# Altium schematic sheet MCU.SchDoc
size 177 x 114 mm; SheetNumber: 1; SheetTotal: 1
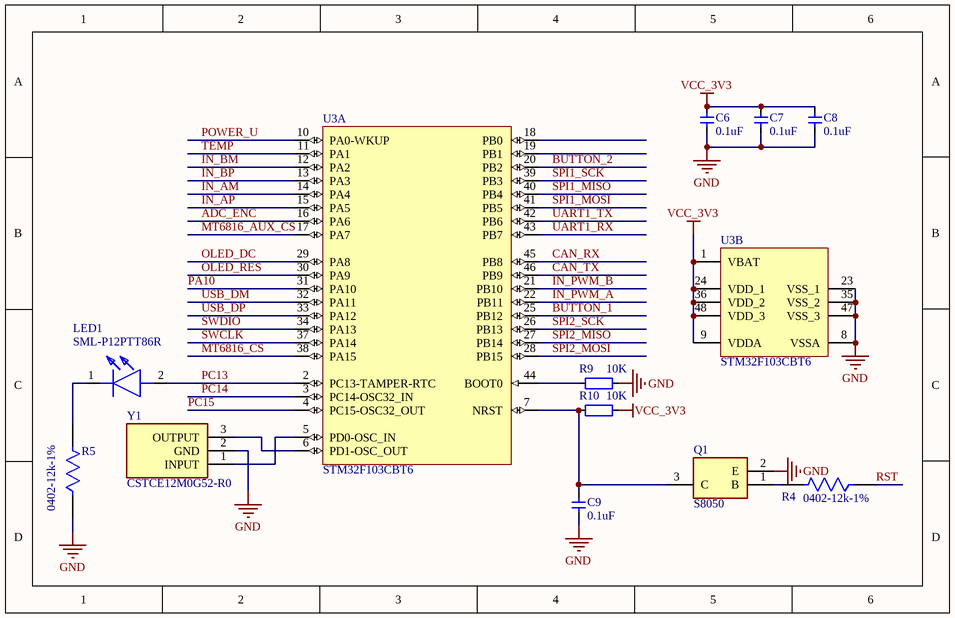
[diagram p0: MCU.SchDoc]

## Parts
C6  0.1uF  [CAP_0402]
C7  0.1uF  [CAP_0402]
C8  0.1uF  [CAP_0402]
C9  0.1uF  [CAP_0402]
LED1  SML-P12PTT86R  [LEDC1006X25N]
Q1  S8050  [SOT95P240X115-3N]
R4  0402-12k-1%  [FP-CRCW0402-e3-IPC_C]
R5  0402-12k-1%  [FP-CRCW0402-e3-IPC_C]
R9  10K  [RES_0402]
R10  10K  [RES_0402]
U3  STM32F103CBT6  [LQFP-48]  (parts A,B of 2)
Y1  CSTCE12M0G52-R0  [CSTCE12M0G52R0]

## Nets
GND: C6.1 C7.1 C8.1 C9.1 Q1.2(E) R5.1 R9.2 U3.8(VSSA) U3.23(VSS_1) U3.35(VSS_2) U3.47(VSS_3) Y1.2(GND)
VCC_3V3: C6.2 C7.2 C8.2 R10.2 U3.1(VBAT) U3.9(VDDA) U3.24(VDD_1) U3.36(VDD_2) U3.48(VDD_3)
ADC_ENC: U3.16(PA6)
BUTTON_1: U3.25(PB12)
BUTTON_2: U3.20(PB2)
CAN_RX: U3.45(PB8)
CAN_TX: U3.46(PB9)
IN_AM: U3.14(PA4)
IN_AP: U3.15(PA5)
IN_BM: U3.12(PA2)
IN_BP: U3.13(PA3)
IN_PWM_A: U3.22(PB11)
IN_PWM_B: U3.21(PB10)
MT6816_AUX_CS: U3.17(PA7)
MT6816_CS: U3.38(PA15)
OLED_DC: U3.29(PA8)
OLED_RES: U3.30(PA9)
PA10: U3.31(PA10)
PC13: LED1.2(A) U3.2(PC13-TAMPER-RTC)
PC14: U3.3(PC14-OSC32_IN)
PC15: U3.4(PC15-OSC32_OUT)
POWER_U: U3.10(PA0-WKUP)
RST: R4.1
SPI1_MISO: U3.40(PB4)
SPI1_MOSI: U3.41(PB5)
SPI1_SCK: U3.39(PB3)
SPI2_MISO: U3.27(PB14)
SPI2_MOSI: U3.28(PB15)
SPI2_SCK: U3.26(PB13)
SWCLK: U3.37(PA14)
SWDIO: U3.34(PA13)
TEMP: U3.11(PA1)
UART1_RX: U3.43(PB7)
UART1_TX: U3.42(PB6)
USB_DM: U3.32(PA11)
USB_DP: U3.33(PA12)
NetC9_2: C9.2 Q1.3(C) R10.1 U3.7(NRST)
NetLED1_1: LED1.1(K) R5.2
NetQ1_1: Q1.1(B) R4.2
NetR9_1: R9.1 U3.44(BOOT0)
NetU3_5: U3.5(PD0-OSC_IN) Y1.1(INPUT)
NetU3_6: U3.6(PD1-OSC_OUT) Y1.3(OUTPUT)

Not connected (* = marked no-connect by the designer): U3 18(PB0) 19(PB1)

## Library data of the parts
C6-C9 = 电容-0402: Capacitor; Value: 0.1u
LED1 = SML-P12PTT86R: LED; Manufacturer_Name: ROHM Semiconductor; Datasheet Link: https://componentsearchengine.com/Datasheets/2/SML-P12PTT86R.pdf; Height: 0.25mm; Manufacturer_Part_Number: SML-P12PTT86R; Mouser Part Number: 755-SML-P12PTT86R; Mouser Price/Stock: https://www.mouser.co.uk/ProductDetail/ROHM-Semiconductor/SML-P12PTT86R?qs=Ei%2Fnxee9QYifz6HhDm1g1Q%3D%3D
Q1 = S8050: Transistor; Manufacturer_Name: Yenji Elec; Datasheet Link: https://datasheet.lcsc.com/szlcsc/Yenji-Elec-S8050_C139514.pdf; Height: 1.15mm; Manufacturer_Part_Number: S8050
R4 R5 = CMP-2002-08122-2: RES Thick Film, 0Ω, 0.063W, 0402; Tolerance: 5%; Max Power Dissipation: 63mW; Voltage Rating: 50V; Temperature Coefficient: 100ppm/°C; Resistance: 0mR; Contact Plating: Tin; Height: 0.35mm; Radiation Hardening: No; Features: Automotive AEC-Q200; Composition: Thick Film; Width: 0.5mm; Weight: 2.3E-05oz; Termination: SMD/SMT; Packaging: Tape and Reel; Mount: Surface Mount; Case Code (Metric): 1005; Military Standard: Not; Min Operating Temperature: -55°C; Number of Terminations: 2; Package Quantity: 1; Case Code (Imperial): 0402; Depth: 0.5mm; Max Operating Temperature: 155°C; Case/Package: 0402; Power Rating: 63mW; Lead Free: Lead Free; Voltage Rating (DC): 50V; Length: 1mm
R9 R10 = 电阻-0402: Resistor; Value: 22R
U3 = STM32F103CBT6: ARM Cortex-M3 32-bit MCU, 128 KB Flash, 20 KB Internal RAM, 37 I/Os, 48-pin LQFP, -40 to 85 degC, Tray; A/D Converter: 2x12-bit (10 Channel); FLASH Size (Prog) (kB): 128; I/Os (High Current): 37; Internal RAM Size (kB): 20; Operating Frequency(F) (Processor speed) (MHz): 72; Supply Voltage(Vcc) min (V): 2; DatasheetVersion: Rev. 16; PackageVersion: Rev. 6, 06/2013; PackageReference: LQFP48; PackageDescription: 48-Pin Low Profile Quad Flat Package, 7 x 7 mm Body, 0.5 mm Pitch; Supplier 1: Digi-Key; Supplier Part Number 1: 497-6288-ND; Supplier 2: Farnell; Supplier Part Number 2: 1606327; Supplier 3: Newark; Supplier Part Number 3: 11N8296; Supplier 4: Newark; Supplier Part Number 4: 57P1214; Supplier 5: Mouser; Supplier Part Number 5: 511-STM32F103CBT6; Core: ARM Cortex-M3; Packing: Tray; Mounting Technology: Surface Mount; PartNumber: STM32F103CBT6; ComponentLink1Description: Manufacturer URL; ComponentLink1URL: http://www.st.com/web/en/home.html; ComponentLink2Description: Datasheet; ComponentLink2URL: http://www.st.com/st-web-ui/static/active/en/resource/technical/document/datasheet/CD00161566.pdf; ComponentLink3Description: Package Specification; ComponentLink3URL: http://www.st.com/st-web-ui/static/active/en/resource/technical/document/datasheet/DM00058181.pdf
Y1 = CSTCE12M0G52-R0: Crystal or Oscillator; Manufacturer_Name: Murata Electronics; Datasheet Link: https://www.murata.com/en-global/products/productdata/8801428045854/SPEC-CSTNE12M0G520000R0.pdf; Height: 0.8mm; Manufacturer_Part_Number: CSTCE12M0G52-R0; Mouser Part Number: 81-CSTCE12M0G52-R0; Mouser Price/Stock: https://www.mouser.co.uk/ProductDetail/Murata-Electronics/CSTCE12M0G52-R0?qs=krk%2F6UQjCzAB%2F8ExIYkEwQ%3D%3D; Arrow Part Number: CSTCE12M0G52-R0; Arrow Price/Stock: https://www.arrow.com/en/products/cstce12m0g52-r0/murata-manufacturing